# Altium schematic sheet charger.SchDoc
size B; SheetNumber: 1
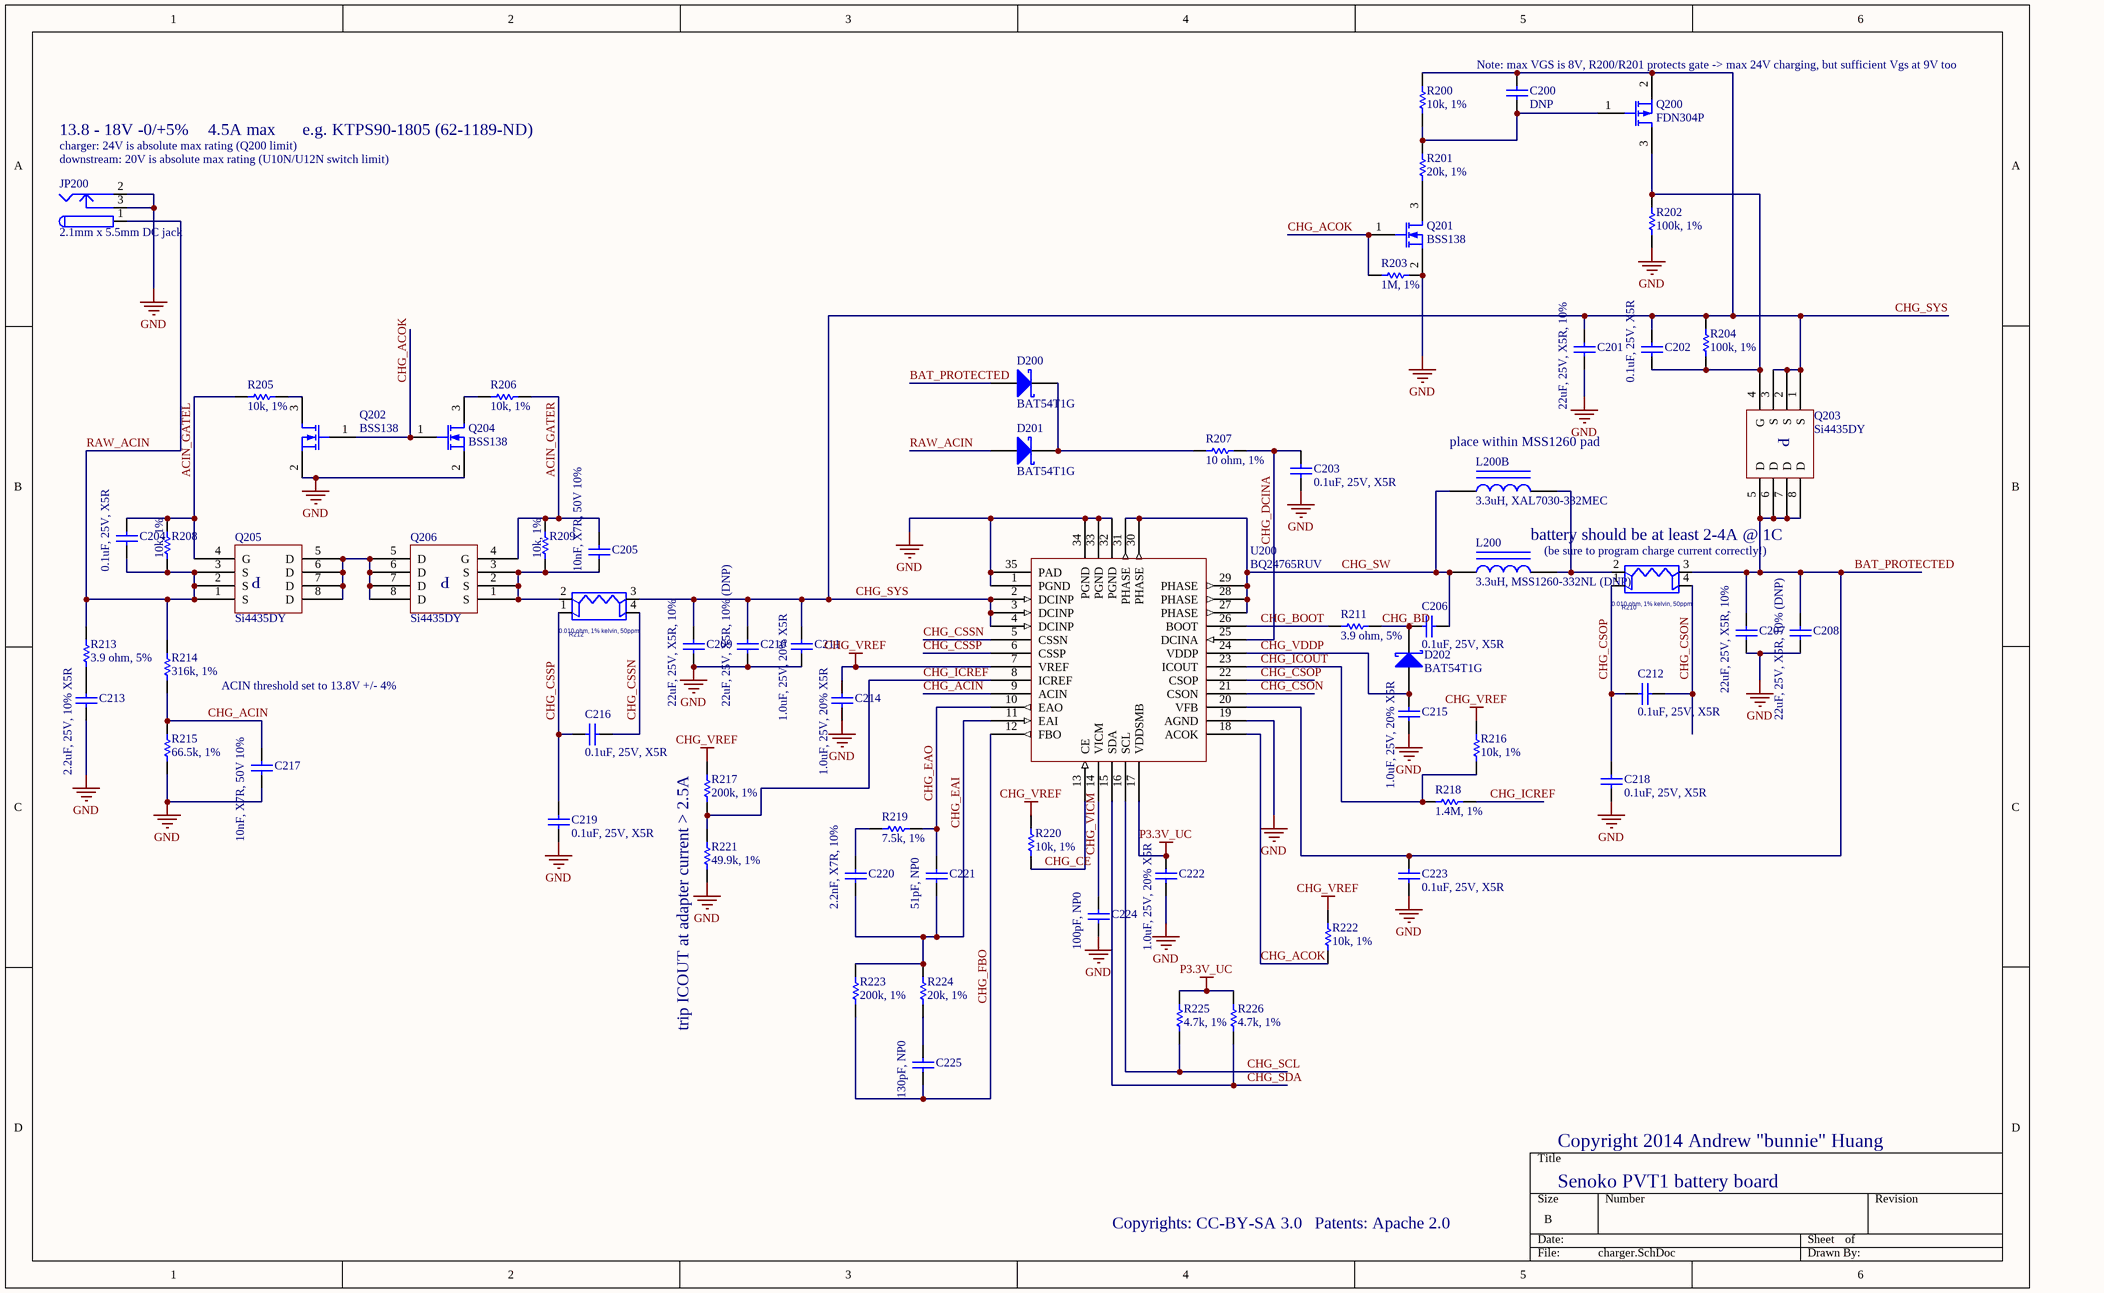
[diagram p0: charger.SchDoc]

## Parts
C200  DNP  [CAPC1005N]
C201  22uF, 25V, X5R, 10%  [CAPC3225N]
C202  0.1uF, 25V, X5R  [CAPC1005N]
C203  0.1uF, 25V, X5R  [CAPC1005N]
C204  0.1uF, 25V, X5R  [CAPC1005N]
C205  10nF, X7R, 50V 10%  [CAPC1005N]
C206  0.1uF, 25V, X5R  [CAPC1005N]
C207  22uF, 25V, X5R, 10%  [CAPC3225N]
C208  22uF, 25V, X5R, 10% (DNP)  [CAPC3225N]
C209  22uF, 25V, X5R, 10%  [CAPC3225N]
C210  22uF, 25V, X5R, 10% (DNP)  [CAPC3225N]
C211  1.0uF, 25V, 20% X5R  [CAPC1608N]
C212  0.1uF, 25V, X5R  [CAPC1005N]
C213  2.2uF, 25V, 10% X5R  [CAPC1608N]
C214  1.0uF, 25V, 20% X5R  [CAPC1608N]
C215  1.0uF, 25V, 20% X5R  [CAPC1608N]
C216  0.1uF, 25V, X5R  [CAPC1005N]
C217  10nF, X7R, 50V 10%  [CAPC1005N]
C218  0.1uF, 25V, X5R  [CAPC1005N]
C219  0.1uF, 25V, X5R  [CAPC1005N]
C220  2.2nF, X7R, 10%  [CAPC1005N]
C221  51pF, NP0  [CAPC1005N]
C222  1.0uF, 25V, 20% X5R  [CAPC1608N]
C223  0.1uF, 25V, X5R  [CAPC1005N]
C224  100pF, NP0  [CAPC1005N]
C225  130pF, NP0  [CAPC1005N]
D200  BAT54T1G  [SOD123]
D201  BAT54T1G  [SOD123]
D202  BAT54T1G  [SOD123]
JP200  2.1mm x 5.5mm DC jack  [CUI_PJ_002AH_SMT]
L200  3.3uH, MSS1260-332NL (DNP)  [COILCRAFT_MSS1048]
L200B  3.3uH, XAL7030-332MEC  [COILCRAFT_XAL7030]
Q200  FDN304P  [SOT23-3N]
Q201  BSS138  [SOT23-3N]
Q202  BSS138  [SOT23-3N]
Q203  Si4435DY  [SOIC127P600-8AN]
Q204  BSS138  [SOT23-3N]
Q205  Si4435DY  [SOIC127P600-8AN]
Q206  Si4435DY  [SOIC127P600-8AN]
R200  10k, 1%  [RESC1005N]
R201  20k, 1%  [RESC1005N]
R202  100k, 1%  [RESC1005N]
R203  1M, 1%  [RESC1005N]
R204  100k, 1%  [RESC1005N]
R205  10k, 1%  [RESC1005N]
R206  10k, 1%  [RESC1005N]
R207  10 ohm, 1%  [RESC1005N]
R208  10k, 1%  [RESC1005N]
R209  10k, 1%  [RESC1005N]
R210  0.010 ohm, 1% kelvin, 50ppm  [OHMITE_LVK_1206_KELVIN]
R211  3.9 ohm, 5%  [RESC1005N]
R212  0.010 ohm, 1% kelvin, 50ppm  [OHMITE_LVK_1206_KELVIN]
R213  3.9 ohm, 5%  [RESC1005N]
R214  316k, 1%  [RESC1005N]
R215  66.5k, 1%  [RESC1005N]
R216  10k, 1%  [RESC1005N]
R217  200k, 1%  [RESC1005N]
R218  1.4M, 1%  [RESC1005N]
R219  7.5k, 1%  [RESC1005N]
R220  10k, 1%  [RESC1005N]
R221  49.9k, 1%  [RESC1005N]
R222  10k, 1%  [RESC1005N]
R223  200k, 1%  [RESC1005N]
R224  20k, 1%  [RESC1005N]
R225  4.7k, 1%  [RESC1005N]
R226  4.7k, 1%  [RESC1005N]
U200  BQ24765RUV  [TI_R-PVQFN-N34]

## Nets
CHG_VREF: C214.1 R216.1 R217.1 R220.1 R222.1 U200.7(VREF)
GND: C201.2 C203.2 C207.2 C208.2 C209.2 C210.2 C211.2 C213.2 C214.2 C215.2 C217.2 C218.1 C219.2 C222.2 C223.1 C224.2 JP200.2 JP200.3 Q201.2(S) Q202.2(S) Q204.2(S) R202.2 R203.1 R215.2 R221.2 U200.1(PGND) U200.19(AGND) U200.32(PGND) U200.33(PGND) U200.34(PGND) U200.35(PAD)
P3.3V_UC: C222.1 R225.1 R226.1 U200.17(VDDSMB)
ACIN_GATEL: C204.1 Q205.4(G) R205.1 R208.2
ACIN_GATER: C205.1 Q206.4(G) R206.2 R209.2
BAT_PROTECTED: C207.1 C208.1 C223.2 D200.1(A) Q203.5(D) Q203.6(D) Q203.7(D) Q203.8(D) R210.3 U200.20(VFB)
CHG_ACIN: C217.1 R214.2 R215.1 U200.9(ACIN)
CHG_ACOK: Q201.1(G) Q202.1(G) Q204.1(G) R203.2 R222.2 U200.18(ACOK)
CHG_BD: C206.1 D202.2(K) R211.2
CHG_BOOT: R211.1 U200.26(BOOT)
CHG_CE: R220.2 U200.13(CE)
CHG_CSON: C212.1 R210.4 U200.21(CSON)
CHG_CSOP: C212.2 C218.2 R210.1 U200.22(CSOP)
CHG_CSSN: C216.2 R212.4 U200.5(CSSN)
CHG_CSSP: C216.1 C219.1 R212.1 U200.6(CSSP)
CHG_DCINA: C203.1 R207.2 U200.25(DCINA)
CHG_EAI: C220.2 C221.2 R223.1 R224.1 U200.11(EAI)
CHG_EAO: C221.1 R219.2 U200.10(EAO)
CHG_FBO: C225.2 R223.2 U200.12(FBO)
CHG_ICOUT: R216.2 R218.2 U200.23(ICOUT)
CHG_ICREF: R217.2 R218.1 R221.1 U200.8(ICREF)
CHG_SCL: R225.2 U200.16(SCL)
CHG_SDA: R226.2 U200.15(SDA)
CHG_SW: C206.2 L200.1 L200B.1 U200.27(PHASE) U200.28(PHASE) U200.29(PHASE) U200.30(PHASE) U200.31(PHASE)
CHG_SYS: C200.2 C201.1 C202.1 C209.1 C210.1 C211.1 Q200.2(S) Q203.1(S) Q203.2(S) Q203.3(S) R200.1 R204.1 R212.3 U200.2(DCINP) U200.3(DCINP) U200.4(DCINP)
CHG_VDDP: C215.1 D202.1(A) U200.24(VDDP)
CHG_VICM: C224.1 U200.14(VICM)
RAW_ACIN: C204.2 D201.1(A) JP200.1 Q205.1(S) Q205.2(S) Q205.3(S) R208.1 R213.1 R214.1
NetC200_1: C200.1 Q200.1(G) R200.2 R201.1
NetC202_2: C202.2 Q200.3(D) Q203.4(G) R202.1 R204.2
NetC205_2: C205.2 Q206.1(S) Q206.2(S) Q206.3(S) R209.1 R212.2
NetC213_1: C213.1 R213.2
NetC220_1: C220.1 R219.1
NetC225_1: C225.1 R224.2
NetD200_2: D200.2(K) D201.2(K) R207.1
NetL200_2: L200.2 L200B.2 R210.2
NetQ201_3: Q201.3(D) R201.2
NetQ202_3: Q202.3(D) R205.2
NetQ204_3: Q204.3(D) R206.1
NetQ205_5: Q205.5(D) Q205.6(D) Q205.7(D) Q205.8(D) Q206.5(D) Q206.6(D) Q206.7(D) Q206.8(D)

## Notes on the sheet
- (near C200) Note: max VGS is 8V, R200/R201 protects gate -> max 24V charging, but sufficient Vgs at 9V too
- 13.8 - 18V -0/+5%
- (near JP200) charger: 24V is absolute max rating (Q200 limit)
- (near JP200) downstream: 20V is absolute max rating (U10N/U12N switch limit)
- 4.5A max
- e.g. KTPS90-1805 (62-1189-ND)
- (near L200B) place within MSS1260 pad
- battery should be at least 2-4A @ 1C
- (be sure to program charge current correctly!)
- ACIN threshold set to 13.8V +/- 4%
- trip ICOUT at adapter current > 2.5A
- Copyright 2014 Andrew "bunnie" Huang
- Copyrights: CC-BY-SA 3.0
- Patents: Apache 2.0
- Senoko PVT1 battery board
- (in symbol Si4435DY) P

## Library data of the parts
C200-C225 = Cap Semi: Capacitor (Semiconductor SIM Model); Published: 8-Jun-2000; LatestRevisionDate: 17-Jul-2002; LatestRevisionNote: Re-released for DXP Platform.; PackageReference: C1206; Publisher: Altium Limited
D200-D202 = D Schottky: Schottky Diode; Code - JEDEC: DO-214-AA; Published: 8-Jun-2000; Publisher: Altium Limited; Revision: July-2002: Re-released for DXP Platform.
JP200 = PWR2.5: Low Voltage Power Supply Connector; Published: 17-Dec-2003; Datasheet: Latest Revision: 09-May-2002; Publisher: Altium Limited
L200 L200B = Inductor Iron: Magnetic-Core Inductor; Published: 24-Mar-1999; LatestRevisionDate: 17-Jul-2002; LatestRevisionNote: Re-released for DXP Platform.; PackageReference: AXIAL-0.9; Publisher: Altium Limited
Q200 = MOSFET-P: P-Channel MOSFET; Published: 8-Jun-2000; LatestRevisionDate: 17-Jul-2002; LatestRevisionNote: Re-released for DXP Platform.; PackageVersion: 1995/1996; PackageReference: E3; Publisher: Altium Limited; PackageDescription: TO, Flat Index; 3 In-Line, Axial Leads; Body Dia. 4.6mm; Lead Dia. 0.5 mm (max)
Q201 Q202 Q204 = MOSFET-N: N-Channel MOSFET; Published: 8-Jun-2000; LatestRevisionDate: 17-Jul-2002; LatestRevisionNote: Re-released for DXP Platform.; PackageVersion: 1995/1996; PackageReference: E3; Publisher: Altium Limited
Q203 Q205 Q206 = Si4435DY: Singre P-channel FET, 8A, 30V
R200 R201 R203 R205-R209 R211 R213-R226 = Res1: Resistor; Value: 100k; Published: 8-Jun-2000; LatestRevisionDate: 17-Jul-2002; LatestRevisionNote: Re-released for DXP Platform.; PackageReference: AXIAL-0.3; Publisher: Altium Limited
R202 R204 = Res1: Resistor; Published: 8-Jun-2000; LatestRevisionDate: 17-Jul-2002; LatestRevisionNote: Re-released for DXP Platform.; PackageReference: AXIAL-0.3; Publisher: Altium Limited; Value: 100k
R210 R212 = RES_4TERM: PART_NUMBER: R00034-001; CDS_LMAN_SYM_OUTLINE: -100,25,100,-75; NEEDS_NO_SIZE: TRUE; PATH: I224; PN: #; OriginalSymbolOrigin: (-100,50); LOCATION: RN32; SEC: 1; XY: (-5650,2000); WATTAGE: 1/2W; PHYS_PAGE: 12; PACK_TYPE: RES1206_4T; MFG_PN: LVK12R020FER; MFG: OHMITE; DRAWING: @BROWNSTONE_LIB.BROWNSTONE(SCH_1):PAGE12; CDS_LIB: resistors; MATERIAL: CH; TOLERANCE: ?; VER: 1; TOL: 1%; ROT: 1; CDS_SEC: 1; CDS_LOCATION: RN32; $TOLERANCE: ?; $SEC: 1; $PN: #; $LOCATION: RN32
U200 = BQ24765RUV: SMBus-controlled battery charger with integrated FETs